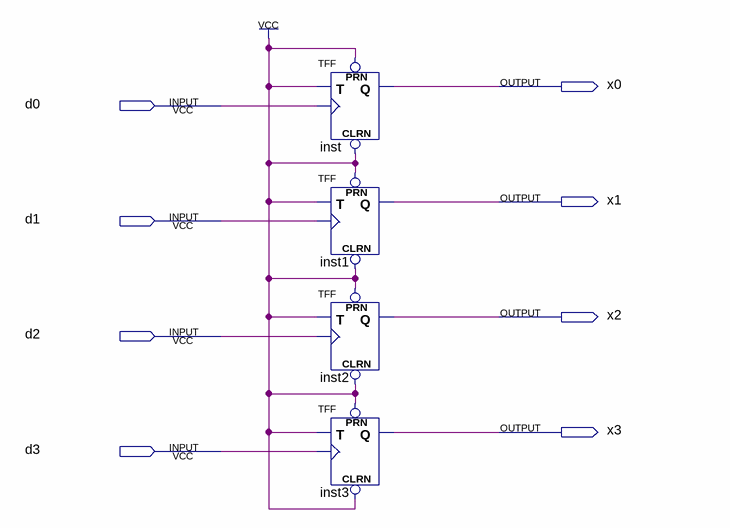
[diagram p0: schematic sheet]
// Quartus schematic Eingangsspeicher.bdf as structural Verilog: 4 symbols, 8 pins
module Eingangsspeicher (
  input  d0,
  input  d1,
  input  d2,
  input  d3,
  output x0,
  output x1,
  output x2,
  output x3
);

  TFF inst (.PRN(1'b1), .CLRN(1'b1), .T(1'b1), .CLK(d0), .Q(x0));
  TFF inst1 (.PRN(1'b1), .CLRN(1'b1), .T(1'b1), .CLK(d1), .Q(x1));
  TFF inst2 (.PRN(1'b1), .CLRN(1'b1), .T(1'b1), .CLK(d2), .Q(x2));
  TFF inst3 (.PRN(1'b1), .CLRN(1'b1), .T(1'b1), .CLK(d3), .Q(x3));
endmodule
